# Altium schematic sheet ESense.SchDoc (part 2 of 4)
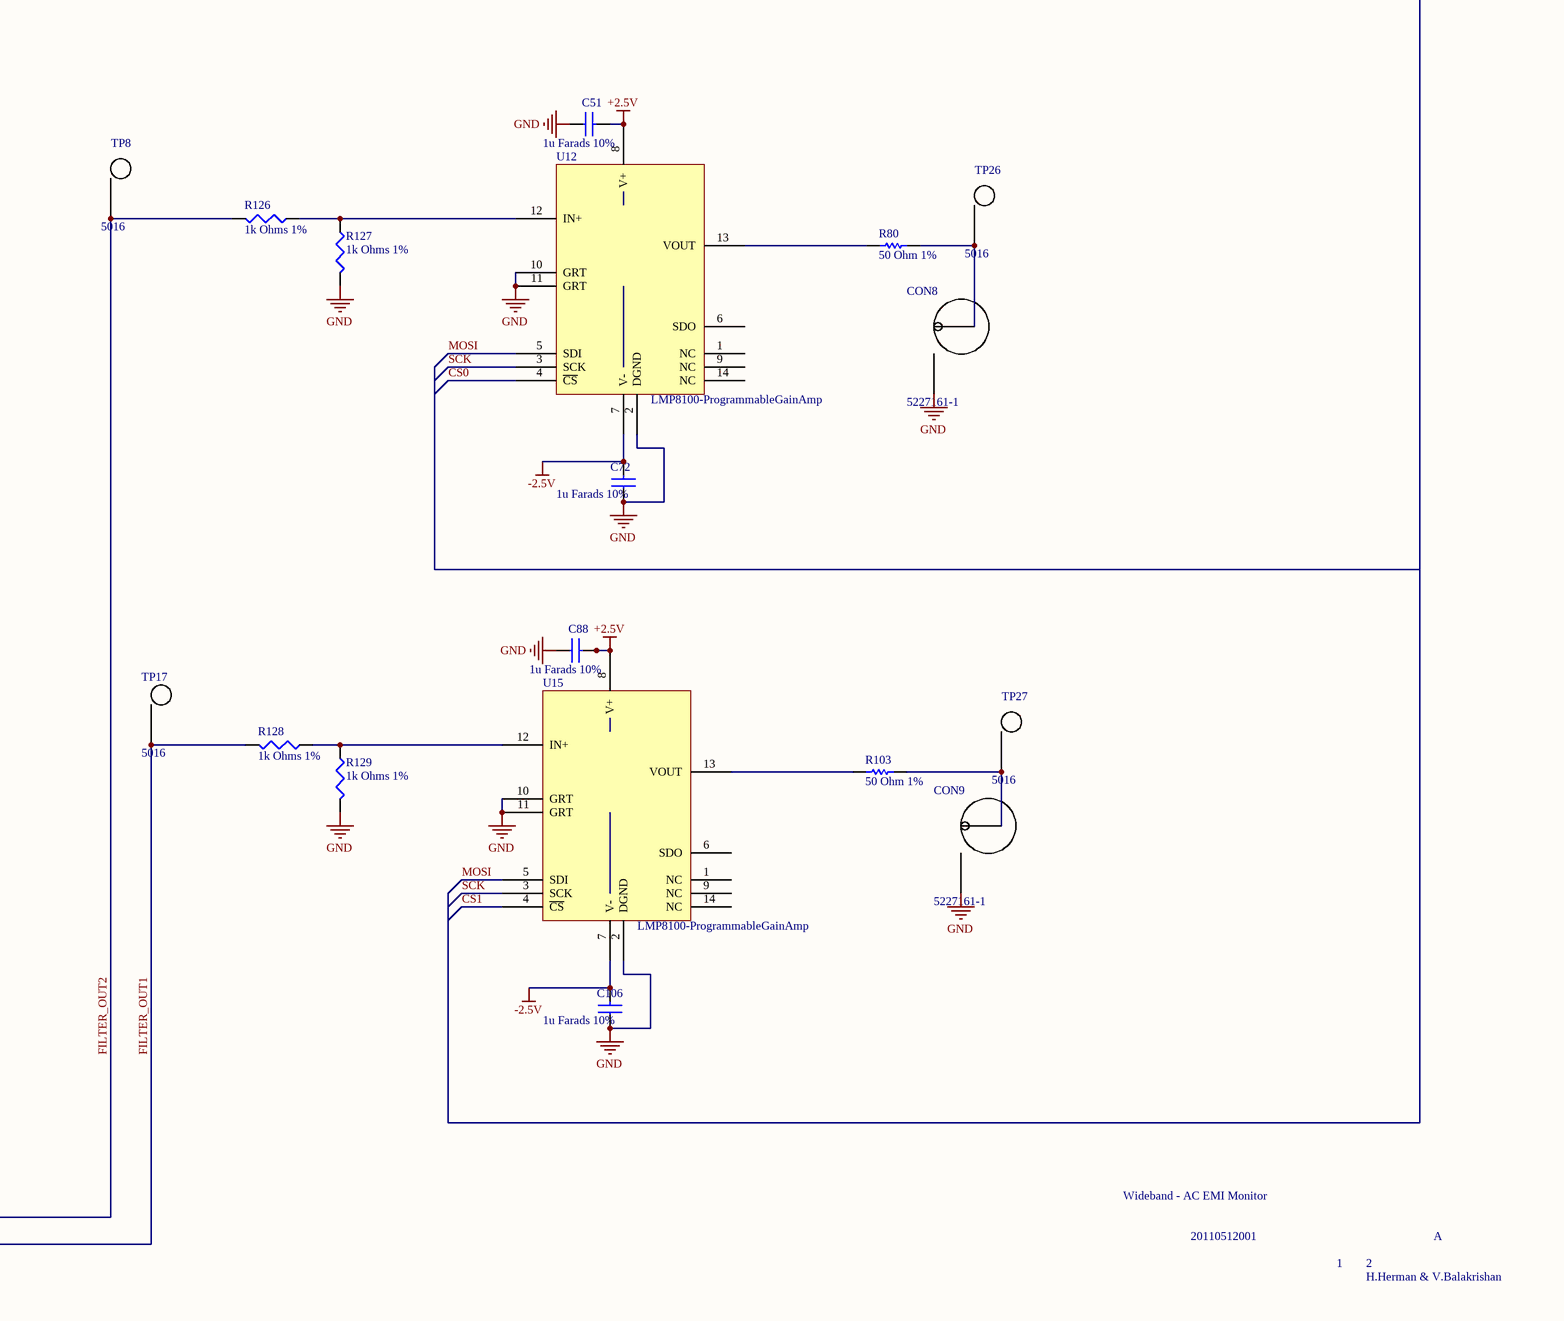
[diagram p9: ESense.SchDoc, bottom right]
## Library data of the parts
C1 C3 C6 C7 C13 C18 C24 C25 = 2178: capacitor, case c, 10uf, 25v; application:general purpose;; mfrName: Panasonic; mfrPartNum: EEE1EA100SR; Label: 1uF; Extra_Description: CAPACITOR, CASE C, 10UF, 25V; Application:General Purpose; Capacitance:10µF; Tolerance, Capacitance:± 20%; Series:VS; Voltage, Rating:25V dc; Capacitor Dielectric Type:Aluminium Electrolytic; Case Style:C; External Length / Height:5.4mm; Body Diameter:5mm; Lead Spacing:1.5mm; Termination Type:SMD; Operating Temperature Range:-40°C to +85°C; AC Ripple Current:28mA; External Depth:5.3mm; Lead Length:2.2mm; Leakage Current:3µA; Operating Lifetime:2000h; Power Factor:0.14; Power Factor Frequency:120Hz; Ripple Current Frequency:120Hz; Temp, Op. Max:85°C; Temp, Op. Min:-40°C; Temperature, Operating Life:85°C; Temperature, Ripple Current:85°C; Tolerance, +:20%; Tolerance, -:20%; Voltage Rating, DC:25V; Width, External:5.3mm; Width, Lead Cross-section:0.65mm; Width, Tape:12mm / Mounting Type: ``Surface Mount`` / Lead-Free Status: ``Lead Free`` / Packaging: ``Cut Tape (CT)`` / Dielectric Material: ``Aluminum Electrolytic`` / RoHS: ``Compliant`` / Size-Height: { / ``uncertainty_minus``: null, / ``value``: 0.0054, / ``uncertainty_plus``: null / } / Voltage Rating (DC): { / ``uncertainty_minus``: null, / ``value``: 25.0, / ``uncertainty_plus``: null / } / Lead Length: { / ``uncertainty_minus``: null, / ``value``: 0.0022, / ``uncertainty_plus``: null / } / Size-Diameter: { / ``uncertainty_minus``: null, / ``value``: 0.005, / ``uncertainty_plus``: null / } / Capacitance: { / ``uncertainty_minus``: null, / ``value``: 1E-05, / ``uncertainty_plus``: null / } / Capacitance Tolerance: { / ``max_value``: 20.0, / ``max_uncertainty_plus``: null, / ``min_value``: -20.0, / ``min_uncertainty_plus``: null, / ``max_uncertainty_minus``: null / } / Operating Temperature: { / ``max_value``: 85.0, / ``max_uncertainty_plus``: null, / ``min_value``: null, / ``min_uncertainty_plus``: null, / ``max_uncertainty_minus``: null / } / Number of Pins: 2; Obsolete: False; Temp_Max: 0; Type: All Parts; TypeNotes: Applies to all parts in the database; PartID: 2178; URL_Image: http://cdn.sigma.octopart.com/8896371/image/Panasonic-EEE1EA100SR.jpg; URL_Datasheet: http://datasheet.octopart.com/EEE1EA100SR-Panasonic-datasheet-5314063.pdf; Date_Created: 5/5/2011 2:23:52 AM; Date_LastModified: 5/5/2011 2:23:52 AM; Verified: False; RoHS: True; Temp_Min: 0
C2 C8 C19 C26 = 2198: cap aluminum 1000uf 25vdc 20% 12.5 x 13.5mm smd 1100ma 5000; mfrName: Panasonic; mfrPartNum: EEV-FK1E102Q; Label: 1uF; Extra_Description: CAP 1000UF 25V ELECT FK SMD / Mounting Type: ``Surface Mount`` / Lead-Free Status: ``Lead Free`` / Packaging: ``Cut Tape (CT)`` / RoHS: ``Compliant`` / Voltage Rating (DC): { / ``uncertainty_minus``: null, / ``value``: 25.0, / ``uncertainty_plus``: null / } / Size-Width: { / ``uncertainty_minus``: null, / ``value``: 0.0135, / ``uncertainty_plus``: null / } / Size-Length: { / ``uncertainty_minus``: null, / ``value``: 0.015, / ``uncertainty_plus``: null / } / Size-Height: { / ``uncertainty_minus``: null, / ``value``: 0.0135, / ``uncertainty_plus``: null / } / Size-Diameter: { / ``uncertainty_minus``: null, / ``value``: 0.0125, / ``uncertainty_plus``: null / } / Capacitance: { / ``uncertainty_minus``: null, / ``value``: 0.001, / ``uncertainty_plus``: null / } / Capacitance Tolerance: { / ``max_value``: 20.0, / ``max_uncertainty_plus``: null, / ``min_value``: -20.0, / ``min_uncertainty_plus``: null, / ``max_uncertainty_minus``: null / } / Operating Temperature: { / ``max_value``: 105.0, / ``max_uncertainty_plus``: null, / ``min_value``: null, / ``min_uncertainty_plus``: null, / ``max_uncertainty_minus``: null / }; Obsolete: False; Temp_Max: 0; Type: All Parts; TypeNotes: Applies to all parts in the database; PartID: 2198; URL_Image: http://cdn.sigma.octopart.com/8933382/image/Panasonic-EEV-FK1E102Q.jpg; URL_Datasheet: http://datasheet.octopart.com/EEV-FK1E102Q-Panasonic-datasheet-48.pdf; Date_Created: 5/7/2011 2:26:18 AM; Date_LastModified: 5/7/2011 2:26:18 AM; Verified: False; RoHS: True; Temp_Min: 0
C4 C5 C16 C17 C27-C30 C33-C36 C40 C44 C45 C48-C51 C59 C60 C62 C63 C72 C81-C84 C88 C102-C106 C115-C118 = 2065: CAP CER 1.0UF 10V 10% X5R 0603; mfrName: Murata Electronics North America; mfrPartNum: GRM188R61A105KA61D; Extra_Description: Datasheets	Chip Monolithic Ceramic Caps Part Numbering / GRM Series Spec/Test Methods (1) / GRM188R61A105KA61 / Product Photos	0603 Murata MLCC Caps / Product Training Modules	High-Cap Multilayer Ceramic Capacitors / Catalog Drawings	GRM Series Top, Sides / Standard Package	10 / Category	Capacitors / Family	Ceramic / Series	GRM / Capacitance	1.0µF / Voltage - Rated	10V / Tolerance	±10% / Temperature Coefficient	X5R / Mounting Type	Surface Mount, MLCC / Operating Temperature	-55°C ~ 85°C / Features	- / Applications	General Purpose / Ratings	- / Package / Case	0603 (1608 Metric) / Size / Dimension	0.063`` L x 0.032`` W (1.60mm x 0.80mm) / Lead Spacing	- / Thickness	0.80mm / Packaging	Cut Tape (CT) / Lead Style	- / Catalog Page	1886 (US2010 Interactive) / 1886 (US2010 PDF) / Other Names	490-1543-1; Obsolete: False; Temp_Max: 0; Type: Ceramic; PartID: 2065; URL_Image: HTTP://MEDIA.DIGIKEY.COM/PHOTOS/MURATA%20PHOTOS/0603%20MURATA%20MLCC%20CAPS.JPG; URL_Datasheet: http://search.murata.co.jp/Ceramy/image/img/w_hinm/L0005E.pdf; Date_Created: 9/27/2010 4:47:48 PM; Date_LastModified: 9/27/2010 4:47:48 PM; Verified: False; RoHS: True; Temp_Min: 0
C9-C12 C14 C15 C20 C21 C31 C32 C37 C38 C42 C43 C46 C47 C52-C58 C61 C64 C66 = 2205: capacitor ceramic 1000pf, 50v, c0g, 0603; dielectric; mfrName: AVX; mfrPartNum: 06035A102FAT2A; Label: 1uF; Extra_Description: CAPACITOR CERAMIC 1000PF, 50V, C0G, 0603; Dielectric Characteristic:C0G/NP0; Capacitance:1000pF; Capacitance Tolerance:± 1%; Voltage Rating:50V; Temperature Coefficient:0 ± 30ppm/°C; Capacitor Case Style:0603; No. of Pins:2 ;RoHS Compliant: Yes / Packaging: ``Tape`` / RoHS: ``Compliant`` / Voltage Rating (DC): { / ``uncertainty_minus``: null, / ``value``: 50.0, / ``uncertainty_plus``: null / } / Capacitance: { / ``uncertainty_minus``: null, / ``value``: 1E-09, / ``uncertainty_plus``: null / } / Capacitance Tolerance: { / ``max_value``: 1.0, / ``max_uncertainty_plus``: null, / ``min_value``: -1.0, / ``min_uncertainty_plus``: null, / ``max_uncertainty_minus``: null / } / Number of Pins: 2; Obsolete: False; Temp_Max: 0; Type: All Parts; TypeNotes: Applies to all parts in the database; PartID: 2205; URL_Image: http://cdn.sigma.octopart.com/8893021/image/AVX-06035A102FAT2A.jpg; URL_Datasheet: http://datasheet.octopart.com/06035A102FAT2A-AVX-datasheet-8446347.pdf; Date_Created: 5/8/2011 9:06:39 AM; Date_LastModified: 5/8/2011 9:06:39 AM; Verified: False; RoHS: True; Temp_Min: 0
C22 C23 = 2202: Y2 Caps 1uF Epocs; mfrName: EPCOS; mfrPartNum: B32026B3105K; Obsolete: False; Temp_Max: 0; Type: All Parts; TypeNotes: Applies to all parts in the database; Label: 1uF; PartID: 2202; Extra_Description: Y2 Caps 1uF Epocs; URL_Image: http://www.mouser.com/images/epcos/images/812007111135.jpg; URL_Datasheet: http://www.epcos.com/inf/20/20/db/fc_2009/Y2_B32021_026.pdf; Date_Created: 5/7/2011 9:37:20 PM; Date_LastModified: 5/7/2011 9:37:20 PM; Verified: False; RoHS: True; Temp_Min: 0
C39 C41 = 2187: ceramic multilayer capacitor; capacitor type:general; mfrName: AVX; mfrPartNum: 06031A220KAT2A; Label: 1uF; Extra_Description: Ceramic Multilayer Capacitor; Capacitor Type:General Purpose; Capacitance:22pF; Capacitance Tolerance:± 10%; Voltage Rating:100VDC; Capacitor Dielectric Type:Multilayer Ceramic; Package/Case:0603; Termination Type:SMD ;RoHS Compliant: Yes / Mounting Type: ``Surface Mount`` / Lead-Free Status: ``Lead Free`` / Packaging: ``Cut Tape (CT)`` / RoHS: ``Compliant`` / Size-Width: { / ``uncertainty_minus``: null, / ``value``: 0.00081, / ``uncertainty_plus``: null / } / Size-Length: { / ``uncertainty_minus``: null, / ``value``: 0.0016, / ``uncertainty_plus``: null / } / Size-Height: { / ``uncertainty_minus``: null, / ``value``: 0.00086, / ``uncertainty_plus``: null / } / Voltage Rating (DC): { / ``uncertainty_minus``: null, / ``value``: 100.0, / ``uncertainty_plus``: null / } / Capacitance: { / ``uncertainty_minus``: null, / ``value``: 2.2E-11, / ``uncertainty_plus``: null / } / Capacitance Tolerance: { / ``max_value``: 10.0, / ``max_uncertainty_plus``: null, / ``min_value``: -10.0, / ``min_uncertainty_plus``: null, / ``max_uncertainty_minus``: null / } / Operating Temperature: { / ``max_value``: 125.0, / ``max_uncertainty_plus``: null, / ``min_value``: null, / ``min_uncertainty_plus``: null, / ``max_uncertainty_minus``: null / } / Number of Pins: 2; Obsolete: False; Temp_Max: 0; Type: All Parts; TypeNotes: Applies to all parts in the database; PartID: 2187; URL_Image: http://cdn.sigma.octopart.com/8893021/image/AVX-06031A220KAT2A.jpg; URL_Datasheet: http://datasheet.octopart.com/06031A220KAT2A-AVX-datasheet-118583.pdf; Date_Created: 5/5/2011 6:57:51 AM; Date_LastModified: 5/5/2011 6:57:51 AM; Verified: False; RoHS: True; Temp_Min: 0
C65 C67 C73-C80 C86 C87 C89 C90 C94-C101 C107-C112 = 2216: ceramic multilayer capacitor; capacitor type:general; mfrName: AVX; mfrPartNum: 06031A470FAT2A; Label: 1uF; Extra_Description: Ceramic Multilayer Capacitor; Capacitor Type:General Purpose; Capacitance:47pF; Capacitance Tolerance:± 1%; Voltage Rating:100VDC; Capacitor Dielectric Type:Multilayer Ceramic; Package/Case:0603; Termination Type:SMD ;RoHS Compliant: Yes / Mounting Type: ``Surface Mount`` / Lead-Free Status: ``Lead Free`` / Packaging: ``Cut Tape (CT)`` / RoHS: ``Compliant`` / Size-Width: { / ``uncertainty_minus``: null, / ``value``: 0.00081, / ``uncertainty_plus``: null / } / Size-Length: { / ``uncertainty_minus``: null, / ``value``: 0.0016, / ``uncertainty_plus``: null / } / Size-Height: { / ``uncertainty_minus``: null, / ``value``: 0.00086, / ``uncertainty_plus``: null / } / Voltage Rating (DC): { / ``uncertainty_minus``: null, / ``value``: 100.0, / ``uncertainty_plus``: null / } / Capacitance: { / ``uncertainty_minus``: null, / ``value``: 4.7E-11, / ``uncertainty_plus``: null / } / Capacitance Tolerance: { / ``max_value``: 1.0, / ``max_uncertainty_plus``: null, / ``min_value``: -1.0, / ``min_uncertainty_plus``: null, / ``max_uncertainty_minus``: null / } / Operating Temperature: { / ``max_value``: 125.0, / ``max_uncertainty_plus``: null, / ``min_value``: null, / ``min_uncertainty_plus``: null, / ``max_uncertainty_minus``: null / } / Number of Pins: 2; Obsolete: False; Temp_Max: 0; Type: All Parts; TypeNotes: Applies to all parts in the database; PartID: 2216; URL_Image: http://cdn.sigma.octopart.com/8893021/image/AVX-06031A470FAT2A.jpg; URL_Datasheet: http://datasheet.octopart.com/06031A470FAT2A-AVX-datasheet-118583.pdf; Date_Created: 5/9/2011 10:45:08 AM; Date_LastModified: 5/9/2011 10:45:08 AM; Verified: False; RoHS: True; Temp_Min: 0
C68 C70 = 2212: capacitor ceramic 330pf, 50v, c0g, 0603; dielectric; mfrName: AVX; mfrPartNum: 06035A331FAT2A; Label: 1uF; Extra_Description: CAPACITOR CERAMIC 330PF, 50V, C0G, 0603; Dielectric Characteristic:C0G/NP0; Capacitance:330pF; Capacitance Tolerance:± 1%; Voltage Rating:50V; Temperature Coefficient:0+/-30 ppm; Capacitor Case Style:0603; No. of Pins:2 ;RoHS Compliant: Yes / Packaging: ``Tape`` / RoHS: ``Compliant`` / Voltage Rating (DC): { / ``uncertainty_minus``: null, / ``value``: 50.0, / ``uncertainty_plus``: null / } / Capacitance: { / ``uncertainty_minus``: null, / ``value``: 3.3E-10, / ``uncertainty_plus``: null / } / Capacitance Tolerance: { / ``max_value``: 1.0, / ``max_uncertainty_plus``: null, / ``min_value``: -1.0, / ``min_uncertainty_plus``: null, / ``max_uncertainty_minus``: null / } / Number of Pins: 2; Obsolete: False; Temp_Max: 0; Type: All Parts; TypeNotes: Applies to all parts in the database; PartID: 2212; URL_Image: http://cdn.sigma.octopart.com/8893021/image/AVX-06035A331FAT2A.jpg; URL_Datasheet: http://www.avx.com/docs/Catalogs/ccog.pdf; Date_Created: 5/9/2011 10:22:55 AM; Date_LastModified: 5/9/2011 10:22:55 AM; Verified: False; RoHS: True; Temp_Min: 0
C69 C71 C85 C91-C93 C113 C114 = 2217: ceramic multilayer capacitor; capacitor type:general; mfrName: AVX; mfrPartNum: 06031A330FAT2A; Label: 1uF; Extra_Description: Ceramic Multilayer Capacitor; Capacitor Type:General Purpose; Capacitance:33pF; Capacitance Tolerance:± 1%; Voltage Rating:100VDC; Capacitor Dielectric Type:Multilayer Ceramic; Package/Case:0603; Termination Type:SMD ;RoHS Compliant: Yes / Mounting Type: ``Surface Mount`` / Lead-Free Status: ``Lead Free`` / Packaging: ``Cut Tape (CT)`` / RoHS: ``Compliant`` / Size-Width: { / ``uncertainty_minus``: null, / ``value``: 0.00081, / ``uncertainty_plus``: null / } / Size-Length: { / ``uncertainty_minus``: null, / ``value``: 0.0016, / ``uncertainty_plus``: null / } / Size-Height: { / ``uncertainty_minus``: null, / ``value``: 0.00086, / ``uncertainty_plus``: null / } / Voltage Rating (DC): { / ``uncertainty_minus``: null, / ``value``: 100.0, / ``uncertainty_plus``: null / } / Capacitance: { / ``uncertainty_minus``: null, / ``value``: 3.3E-11, / ``uncertainty_plus``: null / } / Capacitance Tolerance: { / ``max_value``: 1.0, / ``max_uncertainty_plus``: null, / ``min_value``: -1.0, / ``min_uncertainty_plus``: null, / ``max_uncertainty_minus``: null / } / Operating Temperature: { / ``max_value``: 125.0, / ``max_uncertainty_plus``: null, / ``min_value``: null, / ``min_uncertainty_plus``: null, / ``max_uncertainty_minus``: null / } / Number of Pins: 2; Obsolete: False; Temp_Max: 0; Type: All Parts; TypeNotes: Applies to all parts in the database; PartID: 2217; URL_Image: http://cdn.sigma.octopart.com/8893021/image/AVX-06031A330FAT2A.jpg; URL_Datasheet: http://datasheet.octopart.com/06031A330FAT2A-AVX-datasheet-118583.pdf; Date_Created: 5/9/2011 10:49:16 AM; Date_LastModified: 5/9/2011 10:49:16 AM; Verified: False; RoHS: True; Temp_Min: 0
CN1 = 289: CONN RECEPT USB MINI-B R/A 5POS SMD; mfrName: Molex/Waldom Electronics Corp; mfrPartNum: 54819-0572; Extra_Description: Molex/Waldom Electronics Corp; Lead Free StatusLead Free; RoHS StatusRoHS Compliant; Other Names WM17116CT; Obsolete: False; Temp_Max: 70; Temp_Min: -20; PartID: 289; URL_Image: http://media.digikey.com/photos/Molex/54819-0572.jpg; URL_Datasheet: http://www.mouser.com/index.cfm?handler=displayproduct&lstdispproductid=802959&e_categoryid=620&e_pcodeid=53821; Date_Created: 3/1/2006 10:26:19 PM; Date_LastModified: 8/21/2009 1:12:36 AM; Verified: False; RoHS: True; Type: USB
CON1 CON6-CON9 = 2189: jack bnc, right angle, pcb; connector type:bnc, coaxial;; mfrName: Tyco Electronics; Extra_Description: JACK BNC, RIGHT ANGLE, PCB; Connector Type:BNC, Coaxial; Impedance:50ohm; Contact Material:Phosphor Bronze; Contact Plating:Tin; Body Style:Right Angle; Termination Method:PC Board; Mounting Type:PC Board; External Depth:35.56mm; External Length / Height:13.18mm; Material:VALOX; Width, External:14.76mm; Dielectric Material:Polymethylpentene / Contact Plating: ``Tin`` / Termination Style: ``Solder Lug`` / Gender: ``Female`` / Packaging: ``Bulk`` / RoHS: ``Compliant`` / Mounting Type: ``PC Board`` / Lead-Free Status: ``Lead Free`` / Contact Material: ``Phosphor Bronze`` / Housing Material: ``Polyester`` / Color: ``White`` / Size-Height: { / ``uncertainty_minus``: null, / ``value``: 0.015875, / ``uncertainty_plus``: null / } / Frequency: { / ``max_value``: 4000000000.0, / ``max_uncertainty_plus``: null, / ``min_value``: null, / ``min_uncertainty_plus``: null, / ``max_uncertainty_minus``: null / }; Obsolete: False; Temp_Max: 0; TypeNotes: Applies to all parts in the database; PartID: 2189; mfrPartNum: 5227161-1; URL_Image: http://cdn.sigma.octopart.com/9201634/image/Tyco-Electronics-5227161-1.jpg; URL_Datasheet: http://datasheet.octopart.com/5227161-1-Tyco-Electronics-datasheet-548244.pdf; Date_Created: 5/5/2011 8:50:02 AM; Date_LastModified: 5/5/2011 8:50:02 AM; Verified: False; RoHS: True; Temp_Min: 0; Type: All Parts
CON2-CON5 = 2184: header, vertical, 0.1``, 2way; connector type:wire-to-board;; mfrName: Tyco Electronics; Extra_Description: HEADER, VERTICAL, 0.1``, 2WAY; Connector Type:Wire-to-Board; Gender:Pin; Ways, No. of:2; Lead Spacing:2.54mm; Termination Method:Solder; Contact Material:Copper Alloy; Series:MTA; Contact Plating:Tin; No. of Rows:1; Current Rating:4A; No. of Poles:2; Pitch:0.1``; Voltage Rating, AC:250V; Voltage, Working:250V / Contact Plating: ``Tin`` / Gender: ``Male`` / Packaging: ``Bulk`` / RoHS: ``Compliant`` / Mounting Type: ``Through Hole`` / Lead-Free Status: ``Lead Free`` / Contact Material: ``Copper Alloy`` / Shrouded: ``No`` / Housing Color: ``White`` / Housing Material: ``Polyester`` / Current Rating: { / ``uncertainty_minus``: null, / ``value``: 4.0, / ``uncertainty_plus``: null / } / Pin Pitch: { / ``uncertainty_minus``: null, / ``value``: 0.00254, / ``uncertainty_plus``: null / } / Size-Width: { / ``uncertainty_minus``: null, / ``value``: 0.005715, / ``uncertainty_plus``: null / } / Size-Length: { / ``uncertainty_minus``: null, / ``value``: 0.00508, / ``uncertainty_plus``: null / } / Size-Height: { / ``uncertainty_minus``: null, / ``value``: 0.007874, / ``uncertainty_plus``: null / } / Mounting Angle: { / ``uncertainty_minus``: null, / ``value``: 180.0, / ``uncertainty_plus``: null / } / Voltage Rating (AC): { / ``uncertainty_minus``: null, / ``value``: 250.0, / ``uncertainty_plus``: null / } / Operating Temperature: { / ``max_value``: 105.0, / ``max_uncertainty_plus``: null, / ``min_value``: null, / ``min_uncertainty_plus``: null, / ``max_uncertainty_minus``: null / } / Number of Contacts: 2 / Number of Positions: 2 / Number of Rows: 1; Obsolete: False; Temp_Max: 0; TypeNotes: Applies to all parts in the database; PartID: 2184; mfrPartNum: 640456-2; URL_Image: http://cdn.sigma.octopart.com/9084900/image/Tyco-Electronics-640456-2.jpg; URL_Datasheet: http://datasheet.octopart.com/640456-2-Tyco-Electronics-datasheet-21919.pdf; Date_Created: 5/5/2011 5:31:56 AM; Date_LastModified: 5/5/2011 5:31:56 AM; Verified: False; RoHS: True; Temp_Min: 0; Type: All Parts
CON_L1 CON_N1 = 2177: brass tin plate low profile 10 - 32 thread with anti; mfrName: Keystone; Extra_Description: Brass Tin Plate Low Profile 10 - 32 Thread with Anti Rotation Tab Screw Terminal / Termination Style: ``Crimp`` / Material: ``Brass`` / Packaging: ``Bulk`` / Orientation: ``Straight`` / RoHS: ``Compliant`` / Lead-Free Status: ``Lead Free`` / Color: ``Black``; Obsolete: False; Temp_Max: 0; TypeNotes: Applies to all parts in the database; PartID: 2177; mfrPartNum: 1299; mfrWebsite: http://www.keyelco.com/; URL_Image: http://cdn.sigma.octopart.com/8947666/image/Keystone-1299.jpg; URL_Datasheet: http://datasheet.octopart.com/1299-Keystone-datasheet-23631.pdf; Date_Created: 5/5/2011 1:44:10 AM; Date_LastModified: 5/5/2011 1:44:10 AM; Verified: False; RoHS: True; Temp_Min: 0; Type: All Parts
D1-D4 = 2002: LED SUPER RED CLEAR 0603 SMD; mfrName: LITE-ON INC; mfrPartNum: LTST-C190KRKT; Extra_Description: Datasheets	LTST-C190KRKT / Product Photos	LTST-C190KGKT, LTST-C190KGKT, LTST-C190KSKT, LTST-C190KYKT / Catalog Drawings	LED 0603 Series / LED 0603 Series Side / Standard Package	1 / Category	Optoelectronics / Family	LEDs - <75mA, Discrete / Series	- / Color	Red / Luminous Flux @ Current - Test	196 mlm / Current - Test	20mA / Wavelength - Dominant	631nm / Wavelength - Peak	639nm / Millicandela Rating	54mcd / Voltage - Forward (Vf) Typ	2.0V / Lens Type	Clear / Lens Style/Size	Rectangle, 1.06mm x 0.8mm / Package / Case	0603 (1608 Metric) / Mounting Type	Surface Mount / Viewing Angle	130° / Packaging	Cut Tape (CT) / Size / Dimension	* / Height	* / Catalog Page	2744 (US2010 Interactive) / 2744 (US2010 PDF) / Other Names	160-1436-1; Obsolete: False; Temp_Max: 0; Type: UNKNOWN; Published: 8-Jun-2000; LatestRevisionDate: 17-Jul-2002; LatestRevisionNote: Re-released for DXP Platform.; PackageVersion: Feb-2002; PackageReference: 3.2X1.6X1.1; Publisher: Altium Limited; PartID: 2002; URL_Image: http://media.digikey.com/photos/Lite%20On%20Photos/LTST-C190KGKT,LTST-C190KRKT,LTST-C190KSKT,LTST-C190KYKT_sml.jpg; URL_Datasheet: http://optoelectronics.liteon.com/en-us/api/DwonloadFileHandler.ashx?txtSpecNo=DS-22-99-0151&txtPartNo=LTST-C190KRKT; Date_Created: 7/8/2010 11:36:30 PM; Date_LastModified: 7/8/2010 11:36:30 PM; Verified: False; RoHS: True; Temp_Min: 0
D_STAT1 = 2002: LED SUPER RED CLEAR 0603 SMD; mfrName: LITE-ON INC; mfrPartNum: LTST-C190KRKT; Extra_Description: Datasheets	LTST-C190KRKT / Product Photos	LTST-C190KGKT, LTST-C190KGKT, LTST-C190KSKT, LTST-C190KYKT / Catalog Drawings	LED 0603 Series / LED 0603 Series Side / Standard Package	1 / Category	Optoelectronics / Family	LEDs - <75mA, Discrete / Series	- / Color	Red / Luminous Flux @ Current - Test	196 mlm / Current - Test	20mA / Wavelength - Dominant	631nm / Wavelength - Peak	639nm / Millicandela Rating	54mcd / Voltage - Forward (Vf) Typ	2.0V / Lens Type	Clear / Lens Style/Size	Rectangle, 1.06mm x 0.8mm / Package / Case	0603 (1608 Metric) / Mounting Type	Surface Mount / Viewing Angle	130° / Packaging	Cut Tape (CT) / Size / Dimension	* / Height	* / Catalog Page	2744 (US2010 Interactive) / 2744 (US2010 PDF) / Other Names	160-1436-1; Obsolete: False; Temp_Max: 0; Published: 8-Jun-2000; LatestRevisionDate: 17-Jul-2002; LatestRevisionNote: Re-released for DXP Platform.; PackageVersion: Feb-2002; PackageReference: 3.2X1.6X1.1; Publisher: Altium Limited; PartID: 2002; URL_Image: http://media.digikey.com/photos/Lite%20On%20Photos/LTST-C190KGKT,LTST-C190KRKT,LTST-C190KSKT,LTST-C190KYKT_sml.jpg; URL_Datasheet: http://optoelectronics.liteon.com/en-us/api/DwonloadFileHandler.ashx?txtSpecNo=DS-22-99-0151&txtPartNo=LTST-C190KRKT; Date_Created: 7/8/2010 11:36:30 PM; Date_LastModified: 7/8/2010 11:36:30 PM; Verified: False; RoHS: True; Temp_Min: 0; Type: UNKNOWN
F1 F2 = 1045: FUSEHOLDER OPEN 5X20MM PC MNT; mfrName: Wickmann USA, Inc.; mfrPartNum: 6490000100; Extra_Description: Wickmann USA, Inc. / TypeHolder / Fuse Size5mm x 20mm / MountingPCB / SpecificationsMiniature / MaterialThermoplastic, Black / Other Names19649 / 649 / WK0011; Type: Fuseholders; PartID: 1045; URL_Image: http://media.digikey.com/photos/Wickmann%20Photos/6490000100_sml.jpg; URL_Datasheet: http://www.digikey.com/scripts/DkSearch/dksus.dll?Pname?Name=WK0011-ND&Site=US; Date_Created: 8/1/2004 3:23:57 AM; Date_LastModified: 8/21/2009 1:12:53 AM; Verified: False
J1 = 1838: CONN HEADER 6POS DUAL R/A PCB; mfrName: FCI; mfrPartNum: 75867-131LF; Symbol_Desc: ISP Pinout; Symbol_Desc2: PDI Pinout; Extra_Description: Datasheets	75867 / Product Photos	75867-131LF / Standard Package	100 / Category	Connectors, Interconnects / Family	Rectangular - Headers, Male Pins / Series	Quickie™, Basics+ / Contact Type	Male Pin / Connector Type	Header, Shrouded / Number of Positions	6 / Number of Positions Loaded	All / Pitch	0.100`` (2.54mm) / Number of Rows	2 / Row Spacing	0.100`` (2.54mm) / Contact Mating Length	0.236`` (6.00mm) / Mounting Type	Through Hole, Right Angle / Termination	Solder / Fastening Type	- / Features	- / Contact Finish	Gold, GXT™ / Contact Finish Thickness	30µin (0.76µm) / Color	Blue / Packaging	Tube / Catalog Page	59 (US2010 Interactive) / 59 (US2010 PDF) / Mating Products	609-3567-ND - CONN SOCKET IDC 6POS DL SR 30AU / 71600-206LF-ND - CONN SOCKET IDC 6POS DL SR 30AU / 609-3067-ND - CONN SOCKET IDC 6POS DL 30GOLD / 71600-406LF-ND - QUICKIE / 609-2842-ND - CONN SOCKET IDC 6POS DUAL 30GOLD / 609-2841-ND - CONN SOCKET IDC 6POS DL SR 30AU / Other Names	609-2846; Obsolete: False; Temp_Max: 0; PartID: 1838; mfrWebsite: http://portal.fciconnect.com; URL_Image: http://media.digikey.com/photos/FCI%20Photos/75867-131LF_FCI.JPG; URL_Datasheet: http://portal.fciconnect.com/res/en/pdffiles/doc_search/75867.pdf; Date_Created: 1/16/2010 6:25:16 PM; Date_LastModified: 1/16/2010 6:25:16 PM; Verified: False; RoHS: True; Temp_Min: 0; Type: UNKNOWN
R1 R37 R120-R125 R130-R143 = 2207: res thick film 0603 0 ohm 1/10w molded smd punched carrier; mfrName: Panasonic; mfrPartNum: ERJ-3GEY0R00V; Value: 1K; Extra_Description: RES 0.0 OHM 1/10W 0603 SMD / Mounting Type: ``Surface Mount`` / Case / Package: ``0603`` / Packaging: ``Cut Tape (CT)`` / Lead-Free Status: ``Lead Free`` / RoHS: ``Compliant`` / Size-Width: { / ``uncertainty_minus``: null, / ``value``: 0.0008, / ``uncertainty_plus``: null / } / Resistance: { / ``uncertainty_minus``: null, / ``value``: 0.0, / ``uncertainty_plus``: null / } / Size-Height: { / ``uncertainty_minus``: null, / ``value``: 0.00045, / ``uncertainty_plus``: null / } / Size-Length: { / ``uncertainty_minus``: null, / ``value``: 0.0016, / ``uncertainty_plus``: null / } / Resistance Tolerance: { / ``max_value``: 5.0, / ``max_uncertainty_plus``: null, / ``min_value``: -5.0, / ``min_uncertainty_plus``: null, / ``max_uncertainty_minus``: null / } / Operating Temperature: { / ``max_value``: 125.0, / ``max_uncertainty_plus``: null, / ``min_value``: null, / ``min_uncertainty_plus``: null, / ``max_uncertainty_minus``: null / }; Obsolete: False; Temp_Max: 0; TypeNotes: Applies to all parts in the database; Published: 8-Jun-2000; LatestRevisionDate: 17-Jul-2002; LatestRevisionNote: Re-released for DXP Platform.; PackageReference: AXIAL-0.3; Publisher: Altium Limited; PartID: 2207; URL_Image: http://cdn.sigma.octopart.com/8893006/image/Panasonic-ERJ-3GEY0R00V.jpg; URL_Datasheet: http://datasheet.octopart.com/ERJ-3GEY0R00V-Panasonic-datasheet-118655.pdf; Date_Created: 5/8/2011 9:32:29 AM; Date_LastModified: 5/8/2011 9:32:29 AM; Verified: False; RoHS: True; Temp_Min: 0; Type: All Parts
R2 R38 R39 R80 R103 = 2208: ; resistance:50ohm; resistance tolerance:± 0.1%; power; mfrName: Vishay; mfrPartNum: FC0603E50R0BTBST1; Value: 1K; Extra_Description: ; Resistance:50ohm; Resistance Tolerance:± 0.1%; Power Rating:125mW; Voltage Rating:50V; Temperature Coefficient:± 25ppm/°C; Resistor Element Material:Thin Film; Resistor Case Style:0603; No. of Pins:2 / Power Rating: { / ``uncertainty_minus``: null, / ``value``: 0.125, / ``uncertainty_plus``: null / } / Resistance: { / ``uncertainty_minus``: null, / ``value``: 50.0, / ``uncertainty_plus``: null / } / Voltage Rating (DC): { / ``uncertainty_minus``: null, / ``value``: 50.0, / ``uncertainty_plus``: null / } / Resistance Tolerance: { / ``max_value``: 0.1, / ``max_uncertainty_plus``: null, / ``min_value``: -0.1, / ``min_uncertainty_plus``: null, / ``max_uncertainty_minus``: null / } / Number of Pins: 2; Obsolete: False; Temp_Max: 0; TypeNotes: Applies to all parts in the database; Published: 8-Jun-2000; LatestRevisionDate: 17-Jul-2002; LatestRevisionNote: Re-released for DXP Platform.; PackageReference: AXIAL-0.3; Publisher: Altium Limited; PartID: 2208; URL_Image: http://cdn.sigma.octopart.com/8908821/image/Vishay-FC0603E50R0BTBST1.jpg; URL_Datasheet: http://; Date_Created: 5/8/2011 9:43:35 AM; Date_LastModified: 5/8/2011 9:43:35 AM; Verified: False; RoHS: True; Temp_Min: 0; Type: All Parts
R3 R7 R15 R24 R56 = 2070: RES 330 OHM 1/10W 1% 0603 SMD; mfrName: Panasonic - ECG; mfrPartNum: ERJ-3EKF3300V; Extra_Description: Datasheets	ERJ-3EKF3300V View All Specifications / Product Photos	0603 Pkg / Catalog Drawings	1% Thick Film Chip Material / 1% Thick Film Chip / Standard Package	200 / Category	Resistors / Family	Chip Resistor - Surface Mount / Series	ERJ / Resistance In Ohms	330 / Power (Watts)	0.1W, 1/10W / Composition	Thick Film / Features	- / Temperature Coefficient	±100ppm/°C / Tolerance	±1% / Case	0603 (1608 metric) / Size / Dimension	0.063`` L x 0.031`` W (1.60mm x 0.80mm) / Height	0.018`` (0.45mm) / Lead Style	Surface Mount (SMD - SMT) / Packaging	Cut Tape (CT) / Catalog Page	1954 (US2010 Interactive) / 1954 (US2010 PDF) / Other Names	P330HCT; Obsolete: False; Temp_Max: 0; PartID: 2070; URL_Image: HTTP://MEDIA.DIGIKEY.COM/PHOTOS/PANASONIC%20PHOTOS/10-0603%20RESISTOR.JPG; URL_Datasheet: http://industrial.panasonic.com/www-cgi/jvcr13pz.cgi?E+PZ+3+AOA0002+ERJ3EKF3300V+7+WW; Date_Created: 9/27/2010 6:42:19 PM; Date_LastModified: 9/27/2010 6:42:19 PM; Verified: False; RoHS: True; Temp_Min: 0; Type: Chip Resistor - Surface Mount
R4 R8-R14 R18 R21 R28 R36 R40 R45 R46 R48 R51 R52 R57 R60 R116 R117 R126-R129 = 2043: RES 1.00K OHM 1/10W 1% 0603 SMD; mfrName: Panasonic - ECG; mfrPartNum: ERJ-3EKF1001V; Extra_Description: Datasheets	ERJ-3EKF1001V View All Specifications / Product Photos	0603 Pkg / Catalog Drawings	1% Thick Film Chip Material / 1% Thick Film Chip / Standard Package	200 / Category	Resistors / Family	Chip Resistor - Surface Mount / Series	ERJ / Resistance In Ohms	1.00K / Power (Watts)	0.1W, 1/10W / Composition	Thick Film / Features	- / Temperature Coefficient	±100ppm/°C / Tolerance	±1% / Case	0603 (1608 metric) / Size / Dimension	0.063`` L x 0.031`` W (1.60mm x 0.80mm) / Height	0.018`` (0.45mm) / Lead Style	Surface Mount (SMD - SMT) / Packaging	Cut Tape (CT) / Catalog Page	1954 (US2010 Interactive) / 1954 (US2010 PDF) / Kits	RSM3H-ND - KIT CHIP RES 96 VALUES 50EA 0603 / Other Names	ERJ-3EKF1001 / ERJ3EKF1001 / P1.00KHCT; Obsolete: False; Temp_Max: 0; PartID: 2043; URL_Image: http://media.digikey.com/photos/Panasonic%20Photos/10-0603%20Resistor.jpg?cshift_ck=null&client_id=5042; URL_Datasheet: http://industrial.panasonic.com/www-cgi/jvcr13pz.cgi?E+PZ+3+AOA0002+ERJ3EKF1001V+7+WW; Date_Created: 9/14/2010 11:34:31 AM; Date_LastModified: 9/14/2010 11:34:31 AM; Verified: False; RoHS: True; Temp_Min: 0; Type: Chip Resistor - Surface Mount
R5 R34 R44 R53 = 2165: resistor, 0603, 0.1w, 1%, 10k; resistance:10kohm; resistance; mfrName: Panasonic; mfrPartNum: ERJ-3EKF1002V; Value: 1K; Extra_Description: RESISTOR, 0603, 0.1W, 1%, 10K; Resistance:10kohm; Resistance Tolerance:± 1%; Power Rating:0.1W; Voltage Rating:75V; Series:ERJ; Temperature Coefficient:± 200ppm/°C; Resistor Element Type:Thick Film; Resistor Case Style:0603; No. of Pins:2; Case Style:0603; External Length / Height:0.45mm; External Depth:0.8mm; External Width:1.6mm; Operating Temperature Range:-55°C to +155°C; Overload Voltage:150V; Reel Quantity:5000; Termination Type:SMD / Mounting Type: ``Surface Mount`` / Case / Package: ``0603`` / Packaging: ``Cut Tape (CT)`` / Lead-Free Status: ``Contains Lead`` / RoHS: ``Compliant`` / Resistance: { / ``uncertainty_minus``: null, / ``value``: 10000.0, / ``uncertainty_plus``: null / } / Voltage Rating (DC): { / ``uncertainty_minus``: null, / ``value``: 75.0, / ``uncertainty_plus``: null / } / Size-Width: { / ``uncertainty_minus``: null, / ``value``: 0.0008, / ``uncertainty_plus``: null / } / Size-Length: { / ``uncertainty_minus``: null, / ``value``: 0.0016, / ``uncertainty_plus``: null / } / Size-Height: { / ``uncertainty_minus``: null, / ``value``: 0.00045, / ``uncertainty_plus``: null / } / Power Rating: { / ``uncertainty_minus``: null, / ``value``: 0.1, / ``uncertainty_plus``: null / } / Resistance Tolerance: { / ``max_value``: 1.0, / ``max_uncertainty_plus``: null, / ``min_value``: -1.0, / ``min_uncertainty_plus``: null, / ``max_uncertainty_minus``: null / } / Operating Temperature: { / ``max_value``: 125.0, / ``max_uncertainty_plus``: null, / ``min_value``: null, / ``min_uncertainty_plus``: null, / ``max_uncertainty_minus``: null / } / Number of Pins: 2; Obsolete: False; Temp_Max: 0; TypeNotes: Applies to all parts in the database; Published: 8-Jun-2000; LatestRevisionDate: 17-Jul-2002; LatestRevisionNote: Re-released for DXP Platform.; PackageReference: AXIAL-0.3; Publisher: Altium Limited; PartID: 2165; URL_Image: http://cdn.sigma.octopart.com/8893006/image/Panasonic-ERJ-3EKF1002V.jpg; URL_Datasheet: http://datasheet.octopart.com/ERJ-3EKF1002V-Panasonic-datasheet-118621.pdf; Date_Created: 4/24/2011 7:23:38 AM; Date_LastModified: 4/24/2011 7:23:38 AM; Verified: False; RoHS: True; Temp_Min: 0; Type: All Parts
R6 R35 = 2182: resistor, thick film, 30kohm, 100mw, 1%; resistance:30kohm;; mfrName: Yageo; mfrPartNum: RC0603FR-0730KL; Value: 1K; Extra_Description: RESISTOR, THICK FILM, 30KOHM, 100mW, 1%; Resistance:30kohm; Resistance Tolerance:± 1%; Power Rating:100mW; Voltage Rating:50V; Series:RC0603; Temperature Coefficient:± 100ppm/°C; Resistor Element Material:Thick Film ;RoHS Compliant: Yes / Mounting Type: ``Surface Mount`` / Case / Package: ``0603`` / Packaging: ``Cut Tape (CT)`` / Lead-Free Status: ``Lead Free`` / RoHS: ``Compliant`` / Resistance: { / ``uncertainty_minus``: null, / ``value``: 30000.0, / ``uncertainty_plus``: null / } / Voltage Rating (DC): { / ``uncertainty_minus``: null, / ``value``: 50.0, / ``uncertainty_plus``: null / } / Size-Width: { / ``uncertainty_minus``: null, / ``value``: 0.0008, / ``uncertainty_plus``: null / } / Size-Length: { / ``uncertainty_minus``: null, / ``value``: 0.0016, / ``uncertainty_plus``: null / } / Size-Height: { / ``uncertainty_minus``: null, / ``value``: 0.00045, / ``uncertainty_plus``: null / } / Power Rating: { / ``uncertainty_minus``: null, / ``value``: 0.1, / ``uncertainty_plus``: null / } / Resistance Tolerance: { / ``max_value``: 1.0, / ``max_uncertainty_plus``: null, / ``min_value``: -1.0, / ``min_uncertainty_plus``: null, / ``max_uncertainty_minus``: null / } / Operating Temperature: { / ``max_value``: 155.0, / ``max_uncertainty_plus``: null, / ``min_value``: null, / ``min_uncertainty_plus``: null, / ``max_uncertainty_minus``: null / }; Obsolete: False; Temp_Max: 0; TypeNotes: Applies to all parts in the database; Published: 8-Jun-2000; LatestRevisionDate: 17-Jul-2002; LatestRevisionNote: Re-released for DXP Platform.; PackageReference: AXIAL-0.3; Publisher: Altium Limited; PartID: 2182; URL_Image: http://cdn.sigma.octopart.com/8619856/image/Yageo-RC0603FR-0730KL.jpg; URL_Datasheet: http://datasheet.octopart.com/RC0603FR-0730KL-Yageo-datasheet-118562.pdf; Date_Created: 5/5/2011 4:03:11 AM; Date_LastModified: 5/5/2011 4:03:11 AM; Verified: False; RoHS: True; Temp_Min: 0; Type: All Parts
R16 R17 R19 R20 R22 R23 R25 R26 R41 R42 R49 R50 R54 R55 R58 R59 = 2206: res, thick film, 2.7mohm, 100mw, 1%; resistance:2.7mohm;; mfrName: Vishay; mfrPartNum: CRCW06032M70FKEA; Value: 1K; Extra_Description: RES, THICK FILM, 2.7MOHM, 100mW, 1%; Resistance:2.7Mohm; Resistance Tolerance:± 1%; Power Rating:100mW; Series:CRCW; Temperature Coefficient:± 100ppm; Resistor Element Material:Thick Film; Resistor Case Style:0603; No. of Pins:2 ;RoHS Compliant: Yes / Mounting Type: ``Surface Mount`` / Case / Package: ``0603`` / Packaging: ``Cut Tape (CT)`` / Lead-Free Status: ``Lead Free`` / RoHS: ``Compliant`` / Power Rating: { / ``uncertainty_minus``: null, / ``value``: 0.1, / ``uncertainty_plus``: null / } / Resistance: { / ``uncertainty_minus``: null, / ``value``: 2700000.0, / ``uncertainty_plus``: null / } / Size-Height: { / ``uncertainty_minus``: null, / ``value``: 0.00045, / ``uncertainty_plus``: null / } / Size-Length: { / ``uncertainty_minus``: null, / ``value``: 0.00155, / ``uncertainty_plus``: null / } / Size-Width: { / ``uncertainty_minus``: null, / ``value``: 0.00085, / ``uncertainty_plus``: null / } / Resistance Tolerance: { / ``max_value``: 1.0, / ``max_uncertainty_plus``: null, / ``min_value``: -1.0, / ``min_uncertainty_plus``: null, / ``max_uncertainty_minus``: null / } / Operating Temperature: { / ``max_value``: 150.0, / ``max_uncertainty_plus``: null, / ``min_value``: null, / ``min_uncertainty_plus``: null, / ``max_uncertainty_minus``: null / }; Obsolete: False; Temp_Max: 0; TypeNotes: Applies to all parts in the database; Published: 8-Jun-2000; LatestRevisionDate: 17-Jul-2002; LatestRevisionNote: Re-released for DXP Platform.; PackageReference: AXIAL-0.3; Publisher: Altium Limited; PartID: 2206; URL_Image: http://cdn.sigma.octopart.com/8893816/image/Vishay-CRCW06032M70FKEA.jpg; URL_Datasheet: http://datasheet.octopart.com/CRCW06032M70FKEA-Vishay-datasheet-8445837.pdf; Date_Created: 5/8/2011 9:12:23 AM; Date_LastModified: 5/8/2011 9:12:23 AM; Verified: False; RoHS: True; Temp_Min: 0; Type: All Parts
R27 R32 R33 = 2233: Resistor; mfrName: Panasonic; mfrPartNum: ERO-S2PHF3002-2; Value: 1K; Extra_Description: 30k 1%; Obsolete: False; Temp_Max: 0; TypeNotes: Applies to all parts in the database; Published: 8-Jun-2000; LatestRevisionDate: 17-Jul-2002; LatestRevisionNote: Re-released for DXP Platform.; PackageReference: AXIAL-0.3; Publisher: Altium Limited; PartID: 2233; URL_Image: http://www.mouser.com/images/panasonic/images/prod_res_lpr_ero.jpg; URL_Datasheet: http://www-images.panasonic.com/industrial/components/pdf/AOA0000CE14.pdf; Date_Created: 5/13/2011 10:37:42 AM; Date_LastModified: 5/13/2011 10:37:42 AM; Verified: False; RoHS: True; Temp_Min: 0; Type: All Parts
R29 R30 = 2203: single components passive components resistors; mfrName: Panasonic; mfrPartNum: ERJ-1TNF3002U; Value: 1K; Extra_Description: RES 30.0K OHM 1W 1% 2512 SMD / Mounting Type: ``Surface Mount`` / Case / Package: ``2512`` / Packaging: ``Cut Tape (CT)`` / Lead-Free Status: ``Lead Free`` / RoHS: ``Compliant`` / Size-Width: { / ``uncertainty_minus``: null, / ``value``: 0.0032, / ``uncertainty_plus``: null / } / Resistance: { / ``uncertainty_minus``: null, / ``value``: 30000.0, / ``uncertainty_plus``: null / } / Size-Height: { / ``uncertainty_minus``: null, / ``value``: 0.0006, / ``uncertainty_plus``: null / } / Size-Length: { / ``uncertainty_minus``: null, / ``value``: 0.0064, / ``uncertainty_plus``: null / } / Resistance Tolerance: { / ``max_value``: 1.0, / ``max_uncertainty_plus``: null, / ``min_value``: -1.0, / ``min_uncertainty_plus``: null, / ``max_uncertainty_minus``: null / } / Operating Temperature: { / ``max_value``: 125.0, / ``max_uncertainty_plus``: null, / ``min_value``: null, / ``min_uncertainty_plus``: null, / ``max_uncertainty_minus``: null / }; Obsolete: False; Temp_Max: 0; TypeNotes: Applies to all parts in the database; Published: 8-Jun-2000; LatestRevisionDate: 17-Jul-2002; LatestRevisionNote: Re-released for DXP Platform.; PackageReference: AXIAL-0.3; Publisher: Altium Limited; PartID: 2203; URL_Image: http://cdn.sigma.octopart.com/8892366/image/Panasonic-ERJ-1TNF3002U.jpg; URL_Datasheet: http://industrial.panasonic.com/www-data/pdf/AOA0000/AOA0000PE3.pdf; Date_Created: 5/7/2011 10:12:00 PM; Date_LastModified: 5/7/2011 10:12:00 PM; Verified: False; RoHS: True; Temp_Min: 0; Type: All Parts
R31 = 2204: single components passive components resistors; mfrName: Panasonic; mfrPartNum: ERJ-1TNF15R0U; Value: 1K; Extra_Description: RES 15.0 OHM 1W 1% 2512 SMD / Mounting Type: ``Surface Mount`` / Case / Package: ``2512`` / Packaging: ``Cut Tape (CT)`` / Lead-Free Status: ``Lead Free`` / RoHS: ``Compliant`` / Size-Width: { / ``uncertainty_minus``: null, / ``value``: 0.0032, / ``uncertainty_plus``: null / } / Resistance: { / ``uncertainty_minus``: null, / ``value``: 15.0, / ``uncertainty_plus``: null / } / Size-Height: { / ``uncertainty_minus``: null, / ``value``: 0.0006, / ``uncertainty_plus``: null / } / Size-Length: { / ``uncertainty_minus``: null, / ``value``: 0.0064, / ``uncertainty_plus``: null / } / Resistance Tolerance: { / ``max_value``: 1.0, / ``max_uncertainty_plus``: null, / ``min_value``: -1.0, / ``min_uncertainty_plus``: null, / ``max_uncertainty_minus``: null / } / Operating Temperature: { / ``max_value``: 125.0, / ``max_uncertainty_plus``: null, / ``min_value``: null, / ``min_uncertainty_plus``: null, / ``max_uncertainty_minus``: null / }; Obsolete: False; Temp_Max: 0; TypeNotes: Applies to all parts in the database; Published: 8-Jun-2000; LatestRevisionDate: 17-Jul-2002; LatestRevisionNote: Re-released for DXP Platform.; PackageReference: AXIAL-0.3; Publisher: Altium Limited; PartID: 2204; URL_Image: http://cdn.sigma.octopart.com/8892366/image/Panasonic-ERJ-1TNF15R0U.jpg; URL_Datasheet: http://industrial.panasonic.com/www-data/pdf/AOA0000/AOA0000PE3.pdf; Date_Created: 5/7/2011 10:15:26 PM; Date_LastModified: 5/7/2011 10:15:26 PM; Verified: False; RoHS: True; Temp_Min: 0; Type: All Parts
R43 R47 = 2185: rating:75v; temperature coefficient; mfrName: Panasonic; mfrPartNum: ERJ3EKF22R0V; Value: 1K; Extra_Description: RESISTOR, 0603, 0.1W, 1%, 22R; Resistance:22ohm; Resistance Tolerance:± 1%; Power Rating:0.1W; Voltage Rating:75V; Series:ERJ; Temperature Coefficient:± 200ppm/°C; Resistor Element Type:Thick Film; Resistor Case Style:0603; No. of Pins:2; Case Style:0603; External Length / Height:0.45mm; External Depth:0.8mm; External Width:1.6mm; Operating Temperature Range:-55°C to +155°C; Overload Voltage:150V; Reel Quantity:5000; Termination Type:SMD; Obsolete: False; Temp_Max: 0; TypeNotes: Applies to all parts in the database; Published: 8-Jun-2000; LatestRevisionDate: 17-Jul-2002; LatestRevisionNote: Re-released for DXP Platform.; PackageReference: AXIAL-0.3; Publisher: Altium Limited; PartID: 2185; URL_Image: http://cdn.sigma.octopart.com/8893006/image/Panasonic-ERJ3EKF22R0V.jpg; URL_Datasheet: http://datasheet.octopart.com/ERJ3EKF22R0V-Panasonic-datasheet-5313456.pdf; Date_Created: 5/5/2011 6:06:39 AM; Date_LastModified: 5/5/2011 6:06:39 AM; Verified: False; RoHS: True; Temp_Min: 0; Type: All Parts
R61-R69 = 2165: Resistor; Value: 1K; Published: 8-Jun-2000; LatestRevisionDate: 17-Jul-2002; LatestRevisionNote: Re-released for DXP Platform.; PackageReference: AXIAL-0.3; Publisher: Altium Limited
R70 R71 = 2213: rc series 0603 0.1 w 174 kohms 1% ±100 ppm/°c smt thick film; mfrName: Yageo; mfrPartNum: RC0603FR-07174KL; Value: 1K; Extra_Description: RC Series 0603 0.1 W 174 kOhms 1% ±100 ppm/°C SMT Thick Film Chip Resistor / Mounting Type: ``Surface Mount`` / Case / Package: ``0603`` / Packaging: ``Cut Tape (CT)`` / Lead-Free Status: ``Lead Free`` / RoHS: ``Compliant`` / Size-Width: { / ``uncertainty_minus``: null, / ``value``: 0.0008, / ``uncertainty_plus``: null / } / Resistance: { / ``uncertainty_minus``: null, / ``value``: 174000.0, / ``uncertainty_plus``: null / } / Size-Height: { / ``uncertainty_minus``: null, / ``value``: 0.00045, / ``uncertainty_plus``: null / } / Size-Length: { / ``uncertainty_minus``: null, / ``value``: 0.0016, / ``uncertainty_plus``: null / } / Resistance Tolerance: { / ``max_value``: 1.0, / ``max_uncertainty_plus``: null, / ``min_value``: -1.0, / ``min_uncertainty_plus``: null, / ``max_uncertainty_minus``: null / } / Operating Temperature: { / ``max_value``: 155.0, / ``max_uncertainty_plus``: null, / ``min_value``: null, / ``min_uncertainty_plus``: null, / ``max_uncertainty_minus``: null / }; Obsolete: False; Temp_Max: 0; TypeNotes: Applies to all parts in the database; Published: 8-Jun-2000; LatestRevisionDate: 17-Jul-2002; LatestRevisionNote: Re-released for DXP Platform.; PackageReference: AXIAL-0.3; Publisher: Altium Limited; PartID: 2213; URL_Image: http://cdn.sigma.octopart.com/8893411/image/Yageo-RC0603FR-07174KL.jpg; URL_Datasheet: http://datasheet.octopart.com/RC0603FR-07174KL-Yageo-datasheet-118562.pdf; Date_Created: 5/9/2011 10:33:08 AM; Date_LastModified: 5/9/2011 10:33:08 AM; Verified: False; RoHS: True; Temp_Min: 0; Type: All Parts
R72-R75 = 2210: res thick film 0603 1.15k ohm 1% 1/10w ?100ppm/?c molded smd; mfrName: Panasonic; mfrPartNum: ERJ-3EKF1151V; Value: 1K; Extra_Description: Res Thick Film 0603 1.15K Ohm 1% 1/10W ?100ppm/?C Molded SMD Punched Carrier T/R / Mounting Type: ``Surface Mount`` / Lead-Free Status: ``Lead Free`` / Packaging: ``Tape`` / RoHS: ``Compliant`` / Size-Width: { / ``uncertainty_minus``: null, / ``value``: 0.0008, / ``uncertainty_plus``: null / } / Resistance: { / ``uncertainty_minus``: null, / ``value``: 1150.0, / ``uncertainty_plus``: null / } / Size-Height: { / ``uncertainty_minus``: null, / ``value``: 0.00045, / ``uncertainty_plus``: null / } / Size-Length: { / ``uncertainty_minus``: null, / ``value``: 0.0016, / ``uncertainty_plus``: null / } / Resistance Tolerance: { / ``max_value``: 1.0, / ``max_uncertainty_plus``: null, / ``min_value``: -1.0, / ``min_uncertainty_plus``: null, / ``max_uncertainty_minus``: null / } / Operating Temperature: { / ``max_value``: 125.0, / ``max_uncertainty_plus``: null, / ``min_value``: null, / ``min_uncertainty_plus``: null, / ``max_uncertainty_minus``: null / }; Obsolete: False; Temp_Max: 0; TypeNotes: Applies to all parts in the database; Published: 8-Jun-2000; LatestRevisionDate: 17-Jul-2002; LatestRevisionNote: Re-released for DXP Platform.; PackageReference: AXIAL-0.3; Publisher: Altium Limited; PartID: 2210; URL_Image: http://cdn.sigma.octopart.com/8893006/image/Panasonic-ERJ-3EKF1151V.jpg; URL_Datasheet: http://industrial.panasonic.com/www-cgi/jvcr13pz.cgi?E+PZ+3+AOA0002+ERJ3EKF1153V+7+WW; Date_Created: 5/9/2011 9:45:29 AM; Date_LastModified: 5/9/2011 9:45:29 AM; Verified: False; RoHS: True; Temp_Min: 0; Type: All Parts
R76 R77 = 2214: res thick film 0603 249k ohm 1% 1/10w ?100ppm/?c molded smd; mfrName: Panasonic; mfrPartNum: ERJ-3EKF2493V; Value: 1K; Extra_Description: Res Thick Film 0603 249K Ohm 1% 1/10W |100ppm/|C SMD Punched Carrier T/R / Mounting Type: ``Surface Mount`` / Case / Package: ``0603`` / Packaging: ``Cut Tape (CT)`` / Lead-Free Status: ``Contains Lead`` / RoHS: ``Compliant`` / Size-Width: { / ``uncertainty_minus``: null, / ``value``: 0.0008, / ``uncertainty_plus``: null / } / Resistance: { / ``uncertainty_minus``: null, / ``value``: 249000.0, / ``uncertainty_plus``: null / } / Size-Height: { / ``uncertainty_minus``: null, / ``value``: 0.00045, / ``uncertainty_plus``: null / } / Size-Length: { / ``uncertainty_minus``: null, / ``value``: 0.0016, / ``uncertainty_plus``: null / } / Resistance Tolerance: { / ``max_value``: 1.0, / ``max_uncertainty_plus``: null, / ``min_value``: -1.0, / ``min_uncertainty_plus``: null, / ``max_uncertainty_minus``: null / } / Operating Temperature: { / ``max_value``: 125.0, / ``max_uncertainty_plus``: null, / ``min_value``: null, / ``min_uncertainty_plus``: null, / ``max_uncertainty_minus``: null / }; Obsolete: False; Temp_Max: 0; TypeNotes: Applies to all parts in the database; Published: 8-Jun-2000; LatestRevisionDate: 17-Jul-2002; LatestRevisionNote: Re-released for DXP Platform.; PackageReference: AXIAL-0.3; Publisher: Altium Limited; PartID: 2214; URL_Image: http://cdn.sigma.octopart.com/8893006/image/Panasonic-ERJ-3EKF2493V.jpg; URL_Datasheet: http://datasheet.octopart.com/ERJ-3EKF2493V-Panasonic-datasheet-118621.pdf; Date_Created: 5/9/2011 10:36:12 AM; Date_LastModified: 5/9/2011 10:36:12 AM; Verified: False; RoHS: True; Temp_Min: 0; Type: All Parts
R78 R79 R81 R82 = 2211: res 160k ohm 1/10w 1% 0603 smd; mfrName: Panasonic; mfrPartNum: ERJ-3EKF1603V; Value: 1K; Obsolete: False; Temp_Max: 0; TypeNotes: Applies to all parts in the database; Published: 8-Jun-2000; LatestRevisionDate: 17-Jul-2002; LatestRevisionNote: Re-released for DXP Platform.; PackageReference: AXIAL-0.3; Publisher: Altium Limited; PartID: 2211; Extra_Description: RES 160K OHM 1/10W 1% 0603 SMD; URL_Image: http://cdn.sigma.octopart.com/8893006/image/Panasonic-ERJ-3EKF1603V.jpg; URL_Datasheet: http://www.avx.com/docs/Catalogs/ccog.pdf; Date_Created: 5/9/2011 10:01:53 AM; Date_LastModified: 5/9/2011 10:01:53 AM; Verified: False; RoHS: True; Temp_Min: 0; Type: All Parts
R83-R86 = 2215: res thick film 0603 300k ohm 1% 1/10w ±100ppm/°c molded smd; mfrName: Panasonic; mfrPartNum: ERJ-3EKF3003V; Value: 1K; Extra_Description: Res Thick Film 0603 300K Ohm 1% 1/10W |100ppm/|C SMD Punched Carrier T/R; Obsolete: False; Temp_Max: 0; TypeNotes: Applies to all parts in the database; Published: 8-Jun-2000; LatestRevisionDate: 17-Jul-2002; LatestRevisionNote: Re-released for DXP Platform.; PackageReference: AXIAL-0.3; Publisher: Altium Limited; PartID: 2215; URL_Image: http://cdn.sigma.octopart.com/8893006/image/Panasonic-ERJ-3EKF3003V.jpg; URL_Datasheet: http://; Date_Created: 5/9/2011 10:42:57 AM; Date_LastModified: 5/9/2011 10:42:57 AM; Verified: False; RoHS: True; Temp_Min: 0; Type: All Parts
R87 R88 = 2221: resistor, thick film, 15kohm, 100mw, 1%; resistance:15kohm;; mfrName: Yageo; mfrPartNum: RC0603FR-0715KL; Value: 1K; Extra_Description: RESISTOR, THICK FILM, 15KOHM, 100mW, 1%; Resistance:15kohm; Resistance Tolerance:± 1%; Power Rating:100mW; Voltage Rating:50V; Series:RC0603; Temperature Coefficient:± 100ppm/°C; Resistor Element Material:Thick Film ;RoHS Compliant: Yes / Mounting Type: ``Surface Mount`` / Case / Package: ``0603`` / Packaging: ``Cut Tape (CT)`` / Lead-Free Status: ``Lead Free`` / RoHS: ``Compliant`` / Resistance: { / ``uncertainty_minus``: null, / ``value``: 15000.0, / ``uncertainty_plus``: null / } / Voltage Rating (DC): { / ``uncertainty_minus``: null, / ``value``: 50.0, / ``uncertainty_plus``: null / } / Size-Width: { / ``uncertainty_minus``: null, / ``value``: 0.0008, / ``uncertainty_plus``: null / } / Size-Length: { / ``uncertainty_minus``: null, / ``value``: 0.0016, / ``uncertainty_plus``: null / } / Size-Height: { / ``uncertainty_minus``: null, / ``value``: 0.00045, / ``uncertainty_plus``: null / } / Power Rating: { / ``uncertainty_minus``: null, / ``value``: 0.1, / ``uncertainty_plus``: null / } / Resistance Tolerance: { / ``max_value``: 1.0, / ``max_uncertainty_plus``: null, / ``min_value``: -1.0, / ``min_uncertainty_plus``: null, / ``max_uncertainty_minus``: null / } / Operating Temperature: { / ``max_value``: 155.0, / ``max_uncertainty_plus``: null, / ``min_value``: null, / ``min_uncertainty_plus``: null, / ``max_uncertainty_minus``: null / }; Obsolete: False; Temp_Max: 0; TypeNotes: Applies to all parts in the database; Published: 8-Jun-2000; LatestRevisionDate: 17-Jul-2002; LatestRevisionNote: Re-released for DXP Platform.; PackageReference: AXIAL-0.3; Publisher: Altium Limited; PartID: 2221; URL_Image: http://cdn.sigma.octopart.com/8893411/image/Yageo-RC0603FR-0715KL.jpg; URL_Datasheet: http://datasheet.octopart.com/RC0603FR-0715KL-Yageo-datasheet-118562.pdf; Date_Created: 5/9/2011 11:57:12 AM; Date_LastModified: 5/9/2011 11:57:12 AM; Verified: False; RoHS: True; Temp_Min: 0; Type: All Parts